# Altium schematic sheet BMS_Slave_8S V0.1.SchDoc
size A4; SheetNumber: 1; SheetTotal: 5
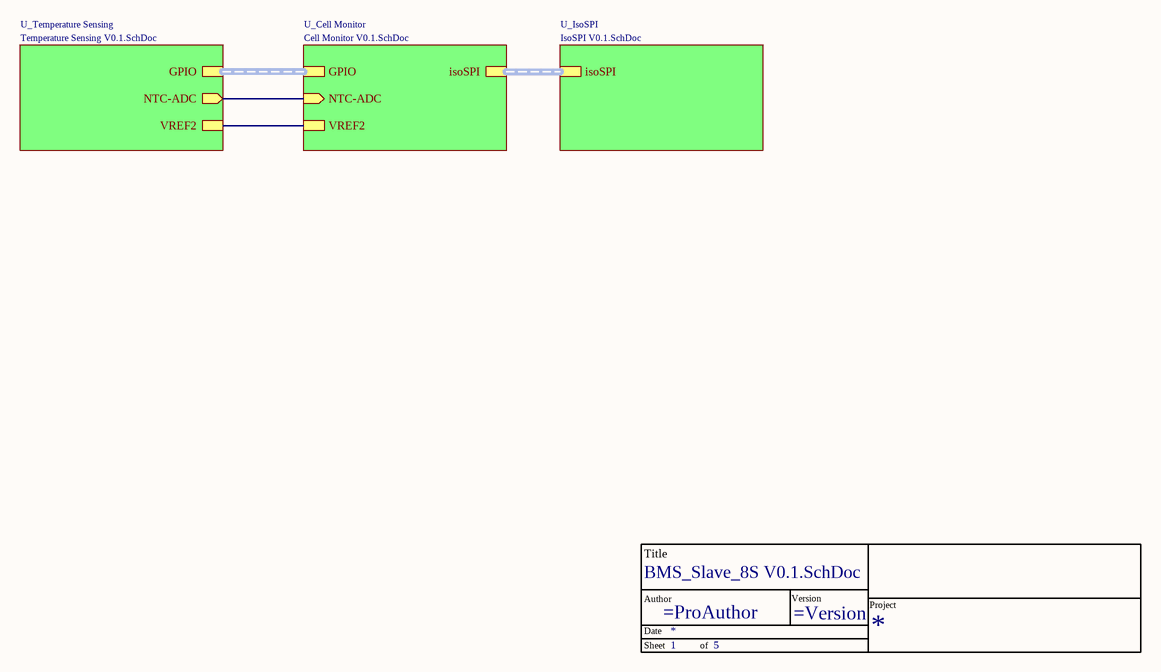
[diagram p0: BMS_Slave_8S V0.1.SchDoc]

## Parts
*  TitleBlock  (value not drawn)  (graphical)

## Sub-sheets
U_Cell Monitor = Cell Monitor V0.1.SchDoc: GPIO (harness GPIO), isoSPI (harness isoSPI), VREF2, NTC-ADC (in)
U_IsoSPI = IsoSPI V0.1.SchDoc: isoSPI (harness isoSPI)
U_Temperature Sensing = Temperature Sensing V0.1.SchDoc: GPIO (harness GPIO), NTC-ADC (out), VREF2

## Nets
(unnamed): sheet U_Cell Monitor/VREF2, sheet U_Temperature Sensing/VREF2
(unnamed): sheet U_Cell Monitor/NTC-ADC, sheet U_Temperature Sensing/NTC-ADC

## Buses and harness runs
harness sheet U_Cell Monitor/GPIO = sheet U_Temperature Sensing/GPIO
harness sheet U_Cell Monitor/isoSPI = sheet U_IsoSPI/isoSPI

## Notes on the sheet
- (in symbol TitleBlock) Title; Author; Version; Project; Date; Sheet; of